# Altium schematic sheet HAL_5.SchDoc
size A
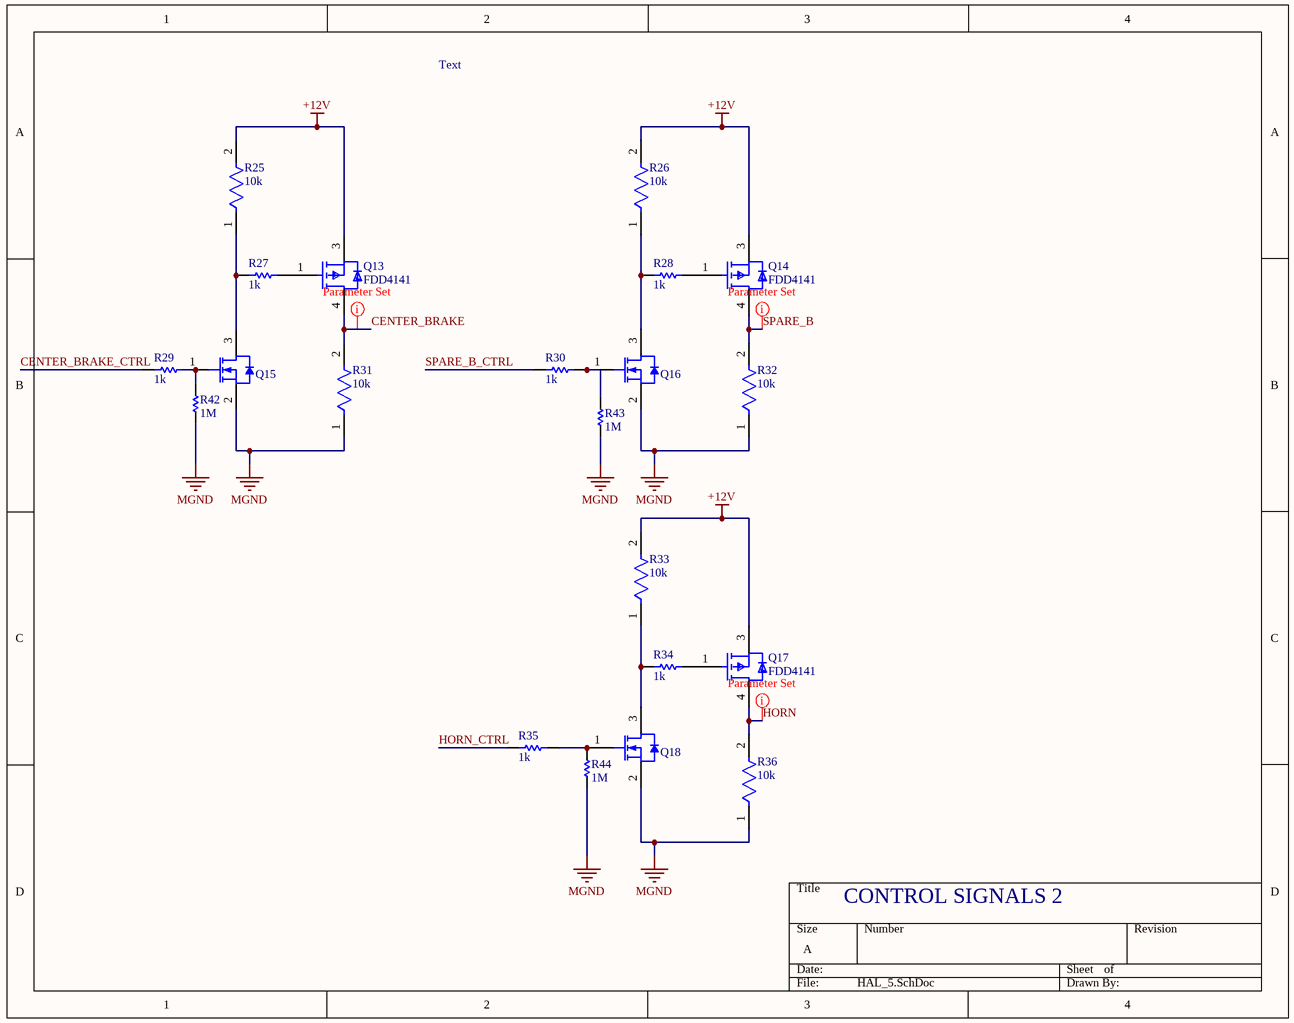
[diagram p0: HAL_5.SchDoc]

## Parts
Q13  FDD4141  [FP-369AS-MFG]
Q14  FDD4141  [FP-369AS-MFG]
Q15  NTR4501NT1G  [ONSC-SOT-23-3-318-08_V]  (value not drawn)
Q16  NTR4501NT1G  [ONSC-SOT-23-3-318-08_V]  (value not drawn)
Q17  FDD4141  [FP-369AS-MFG]
Q18  NTR4501NT1G  [ONSC-SOT-23-3-318-08_V]  (value not drawn)
R25  10k  [FP-RMCF0805-MFG]
R26  10k  [FP-RMCF0805-MFG]
R27  1k  [RESC3216X70X40LL20T20]
R28  1k  [RESC3216X70X40LL20T20]
R29  1k  [RESC3216X70X40LL20T20]
R30  1k  [RESC3216X70X40LL20T20]
R31  10k  [FP-RMCF0805-MFG]
R32  10k  [FP-RMCF0805-MFG]
R33  10k  [FP-RMCF0805-MFG]
R34  1k  [RESC3216X70X40LL20T20]
R35  1k  [RESC3216X70X40LL20T20]
R36  10k  [FP-RMCF0805-MFG]
R42  value 1M  [0603_B]  (hidden comment: CRCW06031M00FKEA)
R43  value 1M  [0603_B]  (hidden comment: CRCW06031M00FKEA)
R44  value 1M  [0603_B]  (hidden comment: CRCW06031M00FKEA)

## Nets
+12V: Q13.3(S) Q14.3(S) Q17.3(S) R25.2 R26.2 R33.2
MGND: Q15.2(S) Q16.2(S) Q18.2(S) R31.1 R32.1 R36.1 R42.1 R43.1 R44.1
CENTER_BRAKE: Q13.4(D) R31.2
CENTER_BRAKE_CTRL: R29.1
HORN: Q17.4(D) R36.2
HORN_CTRL: R35.1
SPARE_B: Q14.4(D) R32.2
SPARE_B_CTRL: R30.1
NetQ13_1: Q13.1(G) R27.2
NetQ14_1: Q14.1(G) R28.2
NetQ15_1: Q15.1(G) R29.2 R42.2
NetQ15_3: Q15.3(D) R25.1 R27.1
NetQ16_1: Q16.1(G) R30.2 R43.2
NetQ16_3: Q16.3(D) R26.1 R28.1
NetQ17_1: Q17.1(G) R34.2
NetQ18_1: Q18.1(G) R35.2 R44.2
NetQ18_3: Q18.3(D) R33.1 R34.1

## Layout directives
rule Width Constraint [Pref Width = 70mil    Min Width = 70mil    Max Width = 70mil]: CENTER_BRAKE, HORN, SPARE_B

## Notes on the sheet
- Text
- CONTROL SIGNALS 2

## Library data of the parts
Q13 Q14 Q17 = CMP-07173-000088-1: MOSFET P-CH 40V 10.8A DPAK; Manufacturer: ON Semiconductor; Gate Charge At Vgs: 36nC @ -10V; Transconductance: 38S; Drain To Source Breakdown Voltage: -40V; Reverse Recovery Time: 29ns; Pulse Drain Current: -100A; Reverse Recovery Charge: 26nC; Drain To Source Resistance: 10.1mΩ; Power Dissipation: 2.4W; Max Forward Diode Voltage: -1.2V; Turn Off Delay Time: 38ns; Number Of P Channels: 1; Gate To Source Voltage: 20V; Rthja Max: 52°C/W; Depletion Mode: False; Threshold Vgs Max: -3V; Threshold Vgs Min: -1V; Turn On Delay Time: 10ns; Max Junction Temp: +150°C; Input Capacitace At Vds: 2085pF @ -20V; Continuous Drain Current: -10.8A; Typ Forward Diode Voltage: -0.8V; Package: 369AS; Category: Diode; RoHS: TRUE; Device Class L2: Transistors; Octopart: https://octopart.com/fdd4141-on+semiconductor-84325802; Temperature: -55°C to +150°C; Drain To Source Voltage: -40V; Device Class L1: Discrete Semiconductors; Temperature Range Low: -55°C; Height: 2.517mm; ComponentLink2Description: Datasheet; Automotive: No; Number Of Channels: 1; Digikey Description: MOSFET P-CH 40V 10.8A DPAK; Lead Free: Yes; Manufacturer Part Number: FDD4141; Temperature Range High: +150°C; Footprint Url: https://www.onsemi.com/pub/Collateral/369AS.PDF; Device Class L3: MOSFETs; Mouser Description: MOSFET -40V P-Channel PowerTrench; ComponentLink2URL: https://www.onsemi.com/pub/Collateral/FDD4141-D.pdf
Q15 Q16 Q18 = CMP-1058-00732-1: Power MOSFET, 20 V, 3.2 A, Single N-Channel, 3-Pin SOT-23, Pb-Free, Tape and Reel; Manufacturer: On Semiconductor; Crss Typ (pF): 50; Ciss Typ (pF): 200; VGS(th) Max (V): 1.2; Coss Typ (pF): 80; PD Max (W): 1.25; VGS Max (V): 12; V(BR)DSS Min (V): 20; Channel Polarity: N Channel; Qrr Typ (nC): 3; PackageReference: SOT-23-3-318-08; ComponentLink2Description: Datasheet; PackageVersion: Rev. AP, 11/2009; ComponentLink1URL: http://www.onsemi.com/; RoHS: Pb-Free; Mounting Technology: Surface Mount; Package Type: SOT-23-3; ComponentLink1Description: Manufacturer URL; PackageDescription: 3-Pin Small Outline Transistor, Body 2.92 x 1.3 mm, Pitch 0.95 mm; Packing: Tape and Reel; PartNumber: NTR4501NT1G; DatasheetVersion: Rev. 13; ComponentLink2URL: http://www.onsemi.cn/pub_link/Collateral/NTR4501N-D.PDF; Configuration: Single; ComponentLink3URL: http://www.onsemi.cn/pub_link/Collateral/318-08.PDF; ComponentLink3Description: Package Specification
R25 R26 R31-R33 R36 = CMP-26527-000121-1: RES 10K OHM 1% 1/8W 0805; Power Rating: 125mW; Resistance: 10kR; Temperature Coefficient: 100ppm/°C; Depth: 1.25mm; Construction: Rectangular; Packaging: Tape and Reel; Tolerance: 1%; Lead Free: Lead Free; Case/Package: 0805; RoHS Compliant: Yes; Series: RMCF; Width: 0.049inch; Max Power Dissipation: 125mW; Contact Plating: Tin; Height: 0.026inch; Mount: Surface Mount; Resistor Type: Thick Film; Size Code: 0805; Length: 2mm; Max Operating Temperature: 155°C; Features: Automotive AEC-Q200; Radiation Hardening: No; Case Code (Imperial): 0805; Min Operating Temperature: -55°C; Case Code (Metric): 2012; Number of Terminations: 2; Military Standard: Not
R27-R30 R34 R35 = CMP-2003-04517-1: RK73B2BTTD102J; Manufacturer: KOA Speer; Part Number: RK73B2BTTD102J
R42-R44 = CRCW06031M00FKEA: 0603 1MOhm resistor; ComponentLink1URL: http://www.vishay.com/doc?20035; ComponentLink1Description: datasheet; supplier1: http://search.digikey.com/scripts/DkSearch/dksus.dll?Detail&name=541-1.00MHCT-ND